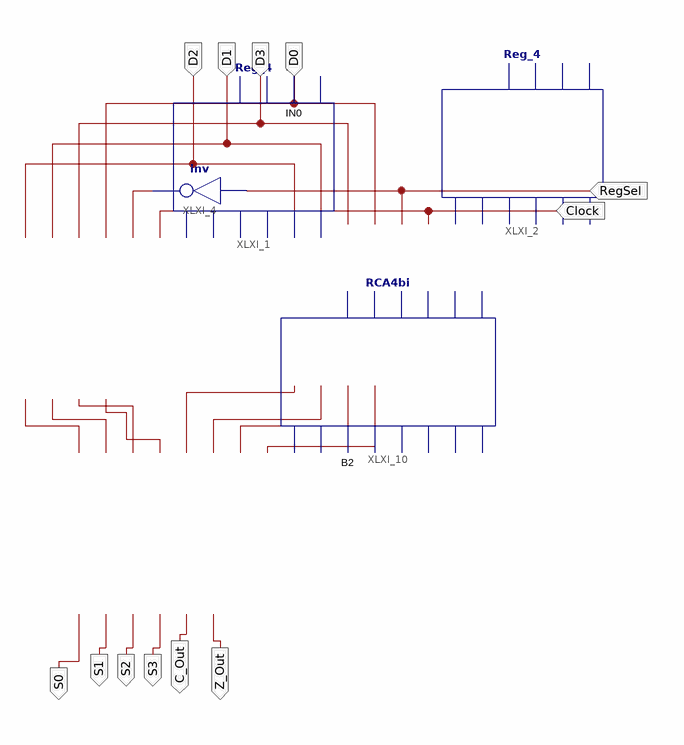
[diagram p0: schematic sheet 1]
// Xilinx ISE schematic AU.sch (spartan3e) as structural Verilog: 4 symbols, 12 ports
module AU (
  input  D0,
  input  D3,
  input  D1,
  input  D2,
  input  Clock,
  input  RegSel,
  output S0,
  output S1,
  output S2,
  output C_Out,
  output Z_Out,
  output S3
);

  wire XLXN_41, XLXN_99, XLXN_100, XLXN_101, XLXN_102, XLXN_103, XLXN_104, XLXN_105, XLXN_115;

  Reg_4 XLXI_1 (
    .C(Clock), .Enable(XLXN_41), .IN0(D0), .IN1(D1), .IN2(D2), .IN3(D3), .OUT0(XLXN_99), .OUT1(XLXN_100),
    .OUT2(XLXN_101), .OUT3(XLXN_115));
  Reg_4 XLXI_2 (
    .C(Clock), .Enable(RegSel), .IN0(D0), .IN1(D1), .IN2(D2), .IN3(D3), .OUT0(XLXN_105), .OUT1(XLXN_104),
    .OUT2(XLXN_103), .OUT3(XLXN_102));
  not XLXI_4 (XLXN_41, RegSel);
  RCA4bi XLXI_10 (
    .A0(XLXN_99), .A1(XLXN_100), .A2(XLXN_101), .A3(XLXN_115), .B0(XLXN_105), .B1(XLXN_104), .B2(XLXN_103),
    .B3(XLXN_102), .C_Overflow(C_Out), .S0(S0), .S1(S1), .S2(S2), .S3(S3), .Zero(Z_Out));
endmodule
